# Altium schematic sheet Power-Connectors.SchDoc
size A4; SheetNumber: 3; SheetTotal: 3
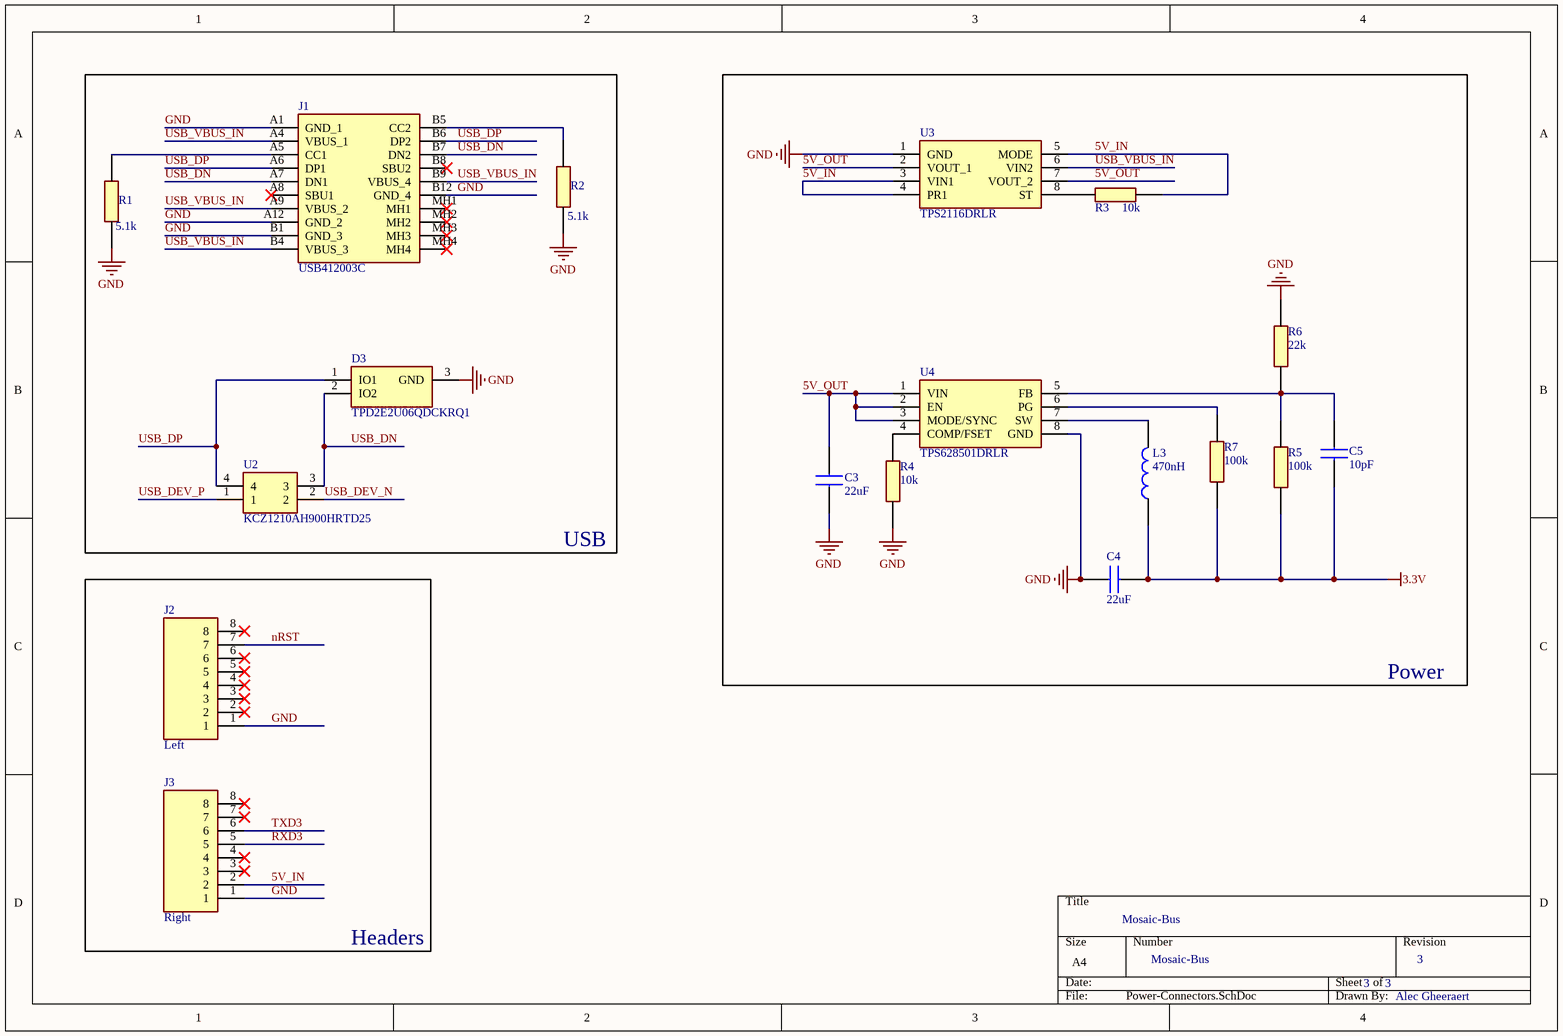
[diagram p0: Power-Connectors.SchDoc]

## Parts
C3  22uF  [CAPC3317X190N]
C4  22uF  [CAPC3317X190N]
C5  10pF  [CAPC1608X95N]
D3  TPD2E2U06QDCKRQ1  [TPD2E2U06QDCKRQ1]
J1  USB412003C  [USB412003C]
J2  Left  [HDRV8W63P0X254_1X8_2032X254X970P]
J3  Right  [HDRV8W63P0X254_1X8_2032X254X970P]
L3  470nH  [INDC2016X100N]
R1  5.1k  [RESC1608X60N]
R2  5.1k  [RESC1608X60N]
R3  10k  [RESC1608X60N]
R4  10k  [RESC1608X60N]
R5  100k  [RESC1608X60N]
R6  22k  [RESC1608X60N]
R7  100k  [RESC1608X60N]
U2  KCZ1210AH900HRTD25  [KCZ1210AH900HRTD25]
U3  TPS2116DRLR  [TPS2116DRLR]
U4  TPS628501DRLR  [TPS628501DRLR]

## Blocks framed on the sheet
USB: D3 J1 R1 R2 U2
Power: C3-C5 L3 R3-R7 U3 U4
Headers: J2 J3

## Nets
3.3V: C4.1 C5.2 L3.1 R5.2 R7.2
GND: C3.1 C4.2 D3.3(GND) J1.A1(GND_1) J1.A12(GND_2) J1.B1(GND_3) J1.B12(GND_4) J2.1 J3.1 R1.2 R2.2 R4.2 R6.1 U3.1(GND) U4.8(GND)
5V_IN: J3.2 R3.2 U3.3(VIN1) U3.4(PR1) U3.5(MODE)
5V_OUT: C3.2 U3.2(VOUT_1) U3.7(VOUT_2) U4.1(VIN) U4.2(EN) U4.3(MODE/SYNC)
nRST: J2.7
RXD3: J3.5
TXD3: J3.6
USB_DEV_N: U2.2
USB_DEV_P: U2.1
USB_DN: D3.2(IO2) J1.A7(DN1) J1.B7(DN2) U2.3
USB_DP: D3.1(IO1) J1.A6(DP1) J1.B6(DP2) U2.4
USB_VBUS_IN: J1.A4(VBUS_1) J1.A9(VBUS_2) J1.B4(VBUS_3) J1.B9(VBUS_4) U3.6(VIN2)
NetC5_1: C5.1 R5.1 R6.2 U4.5(FB)
NetJ1_A5: J1.A5(CC1) R1.1
NetJ1_B5: J1.B5(CC2) R2.1
NetL3_2: L3.2 U4.7(SW)
NetR3_1: R3.1 U3.8(ST)
NetR4_1: R4.1 U4.4(COMP/FSET)
NetR7_1: R7.1 U4.6(PG)

Not connected (* = marked no-connect by the designer): J1 A8(SBU1)* B8(SBU2)* MH1* MH2* MH3* MH4*; J2 2* 3* 4* 5* 6* 8*; J3 3* 4* 7* 8*

## Notes on the sheet
- Mosaic-Bus
- 3
- Alec Gheeraert

## Library data of the parts
C3 C4 = CMP-00015-2: 22uF Capacitor; Manufacturer: Walsin; Capacitance: 22µF; Dielectric: X5R; Tolerance: 10%; VoltageRating: 16V; Size: 3216
C5 = CMP-00005-3: 10pF Capacitor; Manufacturer: Walsin; VoltageRating: 100V; Tolerance: 1%; Dielectric: C0G; Size: 1608; Capacitance: 10pF
D3 = CMP-019-000005-5: TVS Diode Unidirectional 2-Channel; Manufacturer: Texas Instruments; Type: TVS Diode
J1 = CMP-002-000001-6: USB-C Connector 16P Vertical; Manufacturer: Global Connector Technology; Type: USB
J2 J3 = CMP-007-000003-3: Headers & Wire Housings 8P SINGLE ROW
L3 = CMP-00006-6: 470nH Inductor; Manufacturer: Wurth Elektronik; Tolerance: 30%; Frequency: 175MHz; Shielding: Shielded; Size: 2016; Inductance: 470nH
R1 R2 = CMP-052-000000-4: 5.1kOhm Resistor; Manufacturer: Walsin; VoltageRating: 50V; Tolerance: 1%; PowerRating: 100mW; Size: 1608; Resistance: 5.1k
R3 R4 = CMP-052-000001-5: 10kOhm Resistor; Manufacturer: Walsin; VoltageRating: 50V; Tolerance: 5%; PowerRating: 100mW; Resistance: 10k; Size: 1608
R5 R7 = CMP-00007-4: 100kOhm Resistor; Manufacturer: Walsin; Tolerance: 5%; PowerRating: 100mW; VoltageRating: 50V; Resistance: 100k; Size: 1608
R6 = CMP-00008-4: 22kOhm Resistor; Manufacturer: Walsin; Tolerance: 5%; VoltageRating: 50V; PowerRating: 100mW; Resistance: 22k; Size: 1608
U2 = CMP-016-000001-3: Common Mode Filters / Chokes,
U3 = CMP-031-000003-8: Power Multiplexer 1 Output 1.6V-5.5V 2.5A; Manufacturer: Texas Instruments; Type: Power Multiplexer
U4 = CMP-031-000004-6: Switching Voltage Regulator Buck 600mV-5.5V 1A; Manufacturer: Texas Instruments; Type: Switching Voltage Regulator